# EAGLE design BUZZI-31 (EAGLE 4.15)
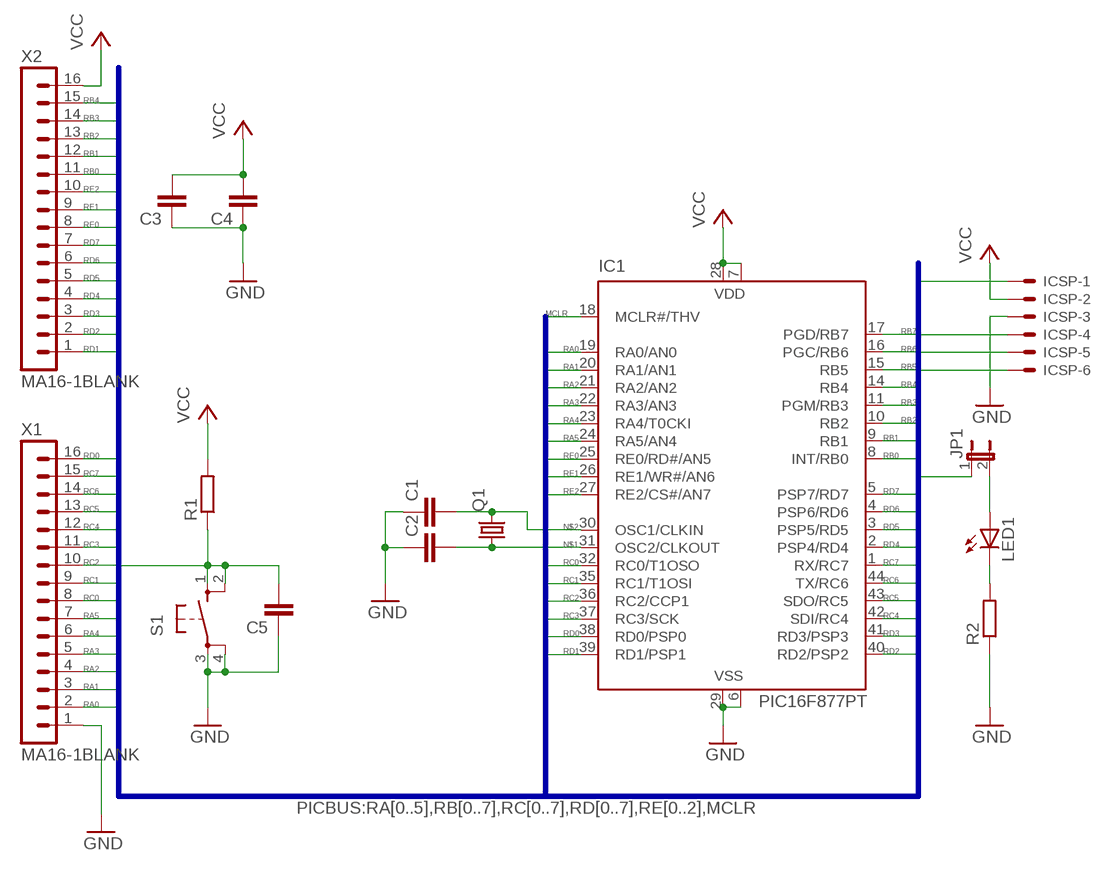
[diagram p0: schematic, sheet 1]

## Parts
C1  C-EUC0805  [C0805]
C2  C-EUC0805  [C0805]
C3  C-EUC0805  [C0805]
C4  C-EUC0805  [C0805]
C5  C-EUC0805  [C0805]
IC1  PIC16F877PT  [TQFP44]
ICSP  53047-06  [53047-06]
JP1  JP1E  [JP1]
LED1  LEDCHIP-LED0805  [CHIP-LED0805]
Q1  CRYTALHC49S  [HC49/S]
R1  R-EU_R0805  [R0805]
R2  R-EU_R0805  [R0805]
S1  10XX  [B3F-10XX]
X1  MA16-1BLANK  [MA16-1-BLANK]
X2  MA16-1BLANK  [MA16-1-BLANK]

## Nets
GND: C1.1 C2.1 C3.1 C4.1 C5.1 IC1.6(VSS) IC1.29(VSS) ICSP.3 R2.1 S1.3 S1.4 X1.1
MCLR: C5.2 IC1.18(MCLR#/THV) ICSP.1 R1.1 S1.1 S1.2
N$1: C2.2 IC1.31(OSC2/CLKOUT) Q1.1
N$2: C1.2 IC1.30(OSC1/CLKIN) Q1.2
N$3: LED1.C R2.2
N$4: JP1.2 LED1.A
RA0: IC1.19(RA0/AN0) X1.2
RA1: IC1.20(RA1/AN1) X1.3
RA2: IC1.21(RA2/AN2) X1.4
RA3: IC1.22(RA3/AN3) X1.5
RA4: IC1.23(RA4/T0CKI) X1.6
RA5: IC1.24(RA5/AN4) X1.7
RB0: IC1.8(INT/RB0) X2.11
RB1: IC1.9(RB1) X2.12
RB2: IC1.10(RB2) X2.13
RB3: IC1.11(PGM/RB3) ICSP.6 X2.14
RB4: IC1.14(RB4) X2.15
RB5: IC1.15(RB5)
RB6: IC1.16(PGC/RB6) ICSP.5
RB7: IC1.17(PGD/RB7) ICSP.4
RC0: IC1.32(RC0/T1OSO) JP1.1 X1.8
RC1: IC1.35(RC1/T1OSI) X1.9
RC2: IC1.36(RC2/CCP1) X1.10
RC3: IC1.37(RC3/SCK) X1.11
RC4: IC1.42(SDI/RC4) X1.12
RC5: IC1.43(SDO/RC5) X1.13
RC6: IC1.44(TX/RC6) X1.14
RC7: IC1.1(RX/RC7) X1.15
RD0: IC1.38(RD0/PSP0) X1.16
RD1: IC1.39(RD1/PSP1) X2.1
RD2: IC1.40(RD2/PSP2) X2.2
RD3: IC1.41(RD3/PSP3) X2.3
RD4: IC1.2(PSP4/RD4) X2.4
RD5: IC1.3(PSP5/RD5) X2.5
RD6: IC1.4(PSP6/RD6) X2.6
RD7: IC1.5(PSP7/RD7) X2.7
RE0: IC1.25(RE0/RD#/AN5) X2.8
RE1: IC1.26(RE1/WR#/AN6) X2.9
RE2: IC1.27(RE2/CS#/AN7) X2.10
VCC: C3.2 C4.2 IC1.7(VDD) IC1.28(VDD) ICSP.2 R1.2 X2.16

## Buses
PICBUS:RA[0..5],RB[0..7],RC[0..7],RD[0..7],RE[0..2],MCLR

## Library data of the parts
C1-C5 = turbod3:C-EU: CAPACITOR, European symbol
IC1 = microchip:PIC16F87*: MICROCONTROLLER
ICSP = con-molex:53?-06: CONNECTOR wire to board 1.25 mm (.049 inch) pitch header
JP1 = jumper:JP1E: JUMPER
LED1 = led:LED: LED OSRAM: - CHIPLED LG R971, LG N971, LY N971, LG Q971, LY Q971, LO R971, LY R971 LH N974, LH R974 LS Q976, LO Q976, LY Q976 LO Q996 - Hyper CHIPLED LW Q18S LB Q993, LB Q99A, LB R99A - SideLED LS A670, LO A670, LY A670, LG A670, LP A670 LB A673, LV A673, LT A673, LW A673 LH A674 LY A675 LS A676, LA A676, LO A676, LY A676, LW A676 LS A679, LY A679, LG A679 - Hyper Micro SIDELED® LS Y876, LA Y876, LO Y876, LY Y876 LT Y87S - SmartLED LW L88C, LW L88S LB L89C, LB L89S, LG L890 LS L89K, LO L89K, LY L89K LS L896, LA L896, LO L896, LY L896 - TOPLED LS T670, LO T670, LY T670, LG T670, LP T670 LSG T670, LSP T670, LSY T670, LOP T670, LYG T670 LG T671, LOG T671, LSG T671 LB T673, LV T673, LT T673, LW T673 LH T674 LS T676, LA T676, LO T676, LY T676, LB T676, LH T676, LSB T676, LW T676 LB T67C, LV T67C, LT T67C, LS T67K, LO T67K, LY T67K, LW E67C LS E67B, LA E67B, LO E67B, LY E67B, LB E67C, LV E67C, LT E67C LW T67C LS T679, LY T679, LG T679 LS T770, LO T770, LY T770, LG T770, LP T770 LB T773, LV T773, LT T773, LW T773 LH T774 LS E675, LA E675, LY E675, LS T675 LS T776, LA T776, LO T776, LY T776, LB T776 LHGB T686 LT T68C, LB T68C - Hyper Mini TOPLED® LB M676 - Mini TOPLED Santana® LG M470 LS M47K, LO M47K, LY M47K Source: http://www.osram.convergy.de/
Q1 = turbod3:CRYTAL: CRYSTAL
R1 R2 = rcl:R-EU_: RESISTOR, European symbol
S1 = KEY_B:10XX
X1 X2 = turbod3:MA16-1

## Board
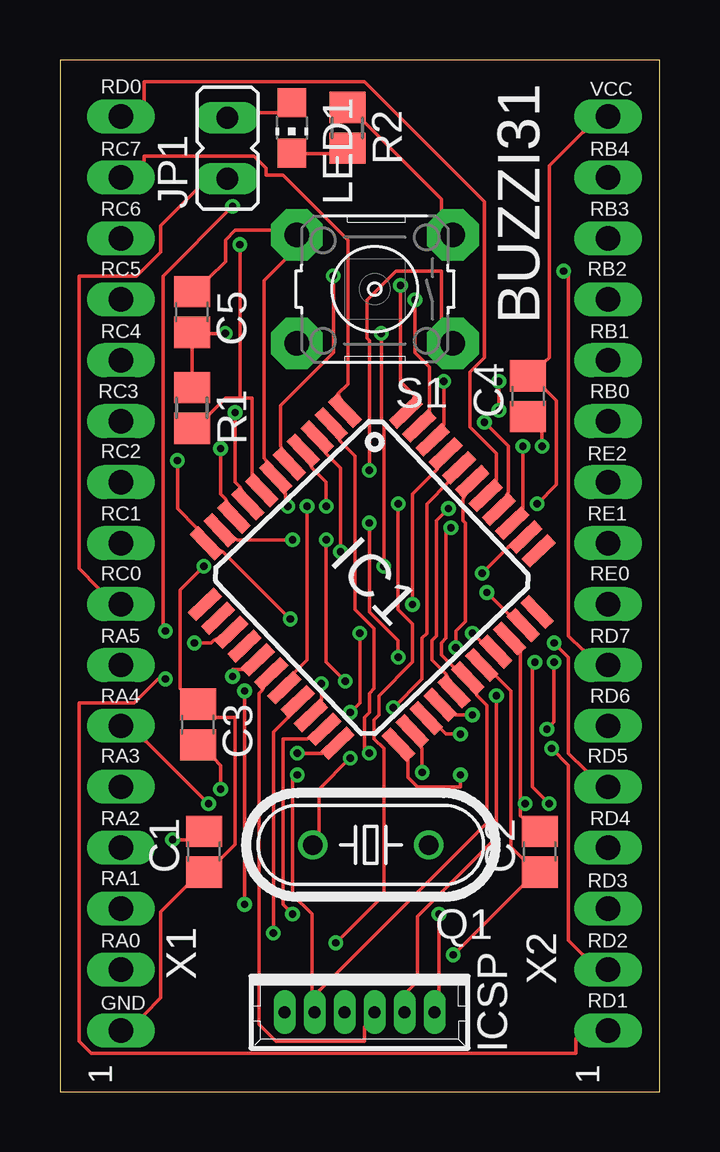
[diagram p1: board, top side]
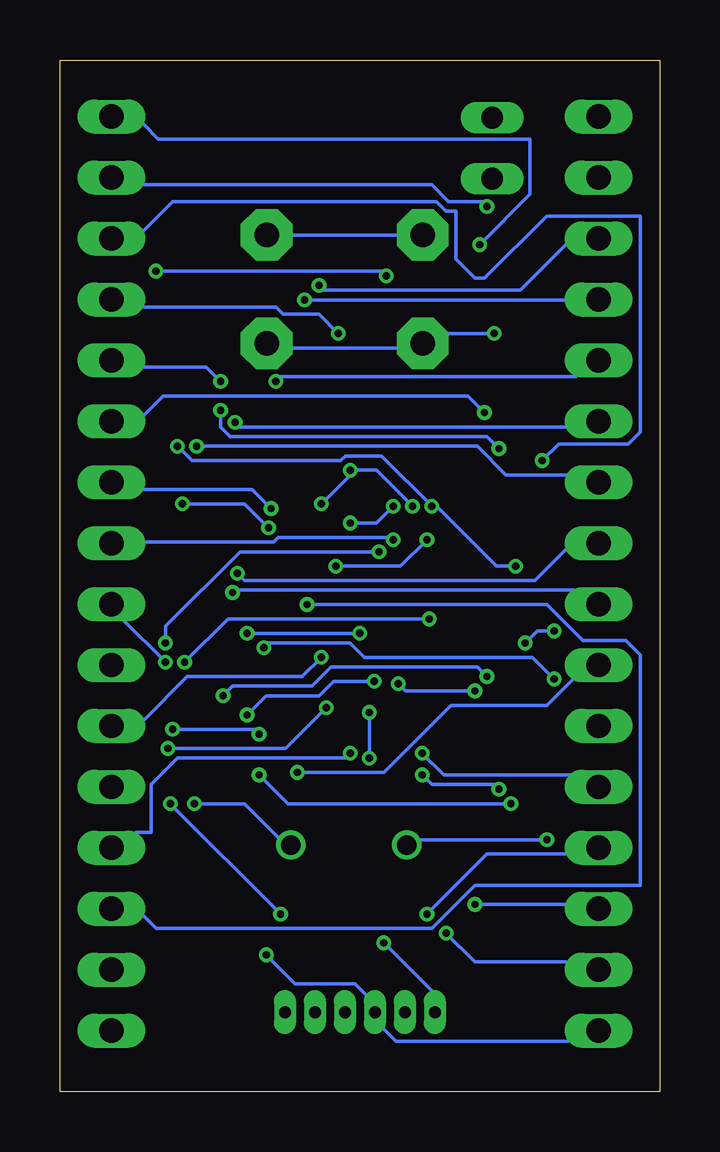
[diagram p2: board, bottom side, seen from below]

Size 25 x 43 mm. Coordinates in mm from the lower left corner, seen from the top.
Outline: 0,0 25,0 25,43 0,43 0,0
Copper layers (1*16): Top 0.035mm / dielectric 1.5mm / Bottom 0.035mm
Design rules "PCB-POOL": minimum track width 6mil, minimum drill 12mil, track to track 6mil, track to pad 6mil, pad to pad 6mil, via to via 6mil, smd to smd 6mil, copper to edge 20mil, drill to drill 8mil, minimum pad ring 8mil, minimum via ring 6mil, stop-mask expansion 3mil, vias tented up to drill 0mil, thermal gap 8mil

### Footprints (pad centres in the part's own frame; a part is rotated, then mirrored left to right if it is on the bottom)
C0805 = smd 1.3 x 1.5: 1 -0.85,0; 2 0.85,0
TQFP44 = smd 1.5 x 0.5: 1 -5.8,4; 2 -5.8,3.2; 3 -5.8,2.4; 4 -5.8,1.6; 5 -5.8,0.8; 6 -5.8,0; 7 -5.8,-0.8; 8 -5.8,-1.6; 9 -5.8,-2.4; 10 -5.8,-3.2; 11 -5.8,-4; 23 5.8,-4; 24 5.8,-3.2; 25 5.8,-2.4; 26 5.8,-1.6; 27 5.8,-0.8; 28 5.8,0; 29 5.8,0.8; 30 5.8,1.6; 31 5.8,2.4; 32 5.8,3.2; 33 5.8,4 | smd 0.5 x 1.5: 12 -4,-5.8; 13 -3.2,-5.8; 14 -2.4,-5.8; 15 -1.6,-5.8; 16 -0.8,-5.8; 17 0,-5.8; 18 0.8,-5.8; 19 1.6,-5.8; 20 2.4,-5.8; 21 3.2,-5.8; 22 4,-5.8; 34 4,5.8; 35 3.2,5.8; 36 2.4,5.8; 37 1.6,5.8; 38 0.8,5.8; 39 0,5.8; 40 -0.8,5.8; 41 -1.6,5.8; 42 -2.4,5.8; 43 -3.2,5.8; 44 -4,5.8
53047-06 = drill 0.5 pad 0.698 long: 1 3.125,0; 2 1.875,0; 3 0.625,0; 4 -0.625,0; 5 -1.875,0; 6 -3.125,0
JP1 = drill 0.914 long: 1 0,-1.27; 2 0,1.27
CHIP-LED0805 = smd 1.2 x 1.2: A 0,-1.05; C 0,1.05
HC49/S = drill 0.813 round: 1 -2.413,0; 2 2.413,0
R0805 = smd 1.3 x 1.5: 1 -0.85,0; 2 0.85,0
B3F-10XX = drill 1.016 pad 2.159 octagon: 1 -3.379,2.312; 2 3.123,2.312; 3 -3.379,-2.209; 4 3.123,-2.209
MA16-1-BLANK = drill 1.016 long: 1 -17.78,0; 2 -15.24,0; 3 -12.7,0; 4 -10.16,0; 5 -7.62,0; 6 -5.08,0; 7 -2.54,0; 8 0,0; 9 2.54,0; 10 5.08,0; 11 7.62,0; 12 10.16,0; 13 12.7,0; 14 15.24,0; 15 17.78,0; 16 20.32,0

### Placement (x,y rotation side)
C1  6,10 90 top
C2  20,10 90 top
C3  5.75,15.3 270 top
C4  19.52,28.98 90 top
C5  5.5,32.5 270 top
IC1  13,21.42 313.7 top
ICSP  12.49,3.31 180 top
JP1  6.98,39.33 0 top
LED1  9.67,40.17 180 top
Q1  12.96,10.28 180 top
R1  5.5,28.5 270 top
R2  11.98,40.17 270 top
S1  13,33.5 180 top
X1  2.54,20.32 90 top
X2  22.86,20.32 90 top

### Tracks (layer width: path | path; a pad name or v marks a point on that pad's centre or on a via)
GND  (via drill 0.3)
  Top 0.152: R2.1 12.7,40.4 15.9,37.2 15.9,36.7 S1.3 | v20.1,26.9 20.1,27.5 C4.1 | v9.5,24.4 9.4,24.5 9.4,24.9 IC1.6 8.6,26.3 8.5,26.4 8.5,33.8 9.4,34.7 S1.4 8.8,35.9 7.3,35.9 6.9,35.5 6.9,34.6 6.2,33.9 C5.1 | IC1.29 18.2,17.3 18.8,16.7 18.8,10.2 19.3,9.7 C2.1 19.3,8.6 v16.4,5.7 | X1.1 3.5,3.2 4.2,3.9 4.2,7.5 5.3,8.6 C1.1 6.7,9.7 7.3,10.3 7.3,15.6 6.4,15.6 C3.1 5.1,16.7 5,16.8 5,20.9 v6,21.9
  Bottom 0.152: v20.1,26.9 19.5,26.3 13.3,26.3 13.1,26.5 11.6,26.5 v9.5,24.4 9.2,24.3 6.8,21.9 v6,21.9 | S1.3 15.3,35.7 10.9,35.7 S1.4 | X1.1 3.8,2.1 11,2.1 11.5,2.6 ICSP.3 12.2,4 12.7,4.5 15.2,4.5 v16.4,5.7
MCLR  (via drill 0.3)
  Top 0.152: R1.1 C5.2 6.2,31.6 v6.9,31.6 | v10.3,24.4 10.3,18 9.8,17.5 IC1.18 | v12.9,25.9 12.9,31.3 12.8,31.4 12.8,33 14,34.2 15.9,34.2 15.9,32.2 S1.1 | v11.5,6.2 13.5,8.2 13.5,14.3 13.1,14.7 13.1,15.5 13.3,15.7 13.3,16.5 14.7,17.9 14.7,19.5 14.1,20.1 v14.1,24.5
  Bottom 0.152: v6.9,31.6 8.8,31.6 S1.2 10.9,31 15.3,31 S1.1 | v10.3,24.4 11.8,25.9 v12.9,25.9 13,25.6 v14.1,24.5 | v11.5,6.2 9.5,4.2 ICSP.1
N$1  (via drill 0.3)
  Top 0.152: 19.2,12 19.2,18.3 IC1.31 | 19.2,12 19.2,11.5 19.3,11.4 C2.2 | v19.4,12 19.2,12
  Bottom 0.152: v19.4,12 17.3,12 15.9,10.6 Q1.1
N$2  (via drill 0.3)
  Top 0.152: v4.7,10.5 5.3,10.5 C1.2 | v17.2,19.1 17.5,18.8 IC1.30 | v12.5,19.1 12.5,16.2 v12.1,15.8 | v12.1,13.9 10.8,12.6 10.8,10.8 Q1.2
  Bottom 0.152: v4.7,10.5 10,10.5 Q1.2 | v12.5,19.1 v17.2,19.1 | v12.1,13.9 v12.1,15.8
N$3
  Top 0.152: LED1.C 10.2,39.1 11.3,39.1 R2.2
N$4
  Top 0.152: LED1.A 9.1,40.8 8.3,40.8 JP1.2
RA0  (via drill 0.3)
  Top 0.152: v8.9,6.6 8.9,15 9.5,15.6 IC1.19
  Bottom 0.152: v8.9,6.6 7.7,5.4 3.9,5.4 X1.2
RA1  (via drill 0.3)
  Top 0.152: v10.9,17 10.9,16.3 IC1.20 | v7.7,7.8 v7.7,16.7
  Bottom 0.152: v10.9,17 10.6,16.7 v7.7,16.7 | v7.7,7.8 3.9,7.8 X1.3
RA2  (via drill 0.3)
  Top 0.152: v9.7,7.4 9.3,7.8 9.3,14.7 10.3,14.7 IC1.21
  Bottom 0.152: v9.7,7.4 7.2,9.9 3.9,9.9 X1.4
RA3  (via drill 0.3)
  Top 0.152: v9.9,14.1 10.9,14.1 IC1.22
  Bottom 0.152: v9.9,14.1 9,13.2 3.7,13.2 X1.5
RA4  (via drill 0.3)
  Top 0.152: v16.7,13.2 16.7,12.7 14.9,12.7 14.5,13.1 14.5,13.8 IC1.23 | v6.2,12 3.6,14.6 X1.6
  Bottom 0.152: v16.7,13.2 15.5,12 v6.2,12
RA5  (via drill 0.3)
  Top 0.152: v15.1,13.3 15.1,14.3 IC1.24
  Bottom 0.152: v15.1,13.3 11.5,13.3 8.7,16.1 4.7,16.1 3.6,17.2 X1.7
RB0  (via drill 0.3)
  Top 0.152: v7.3,28.3 7.3,25.4 7.5,25.2 IC1.8
  Bottom 0.152: v7.3,28.3 8,29 20.7,29 21.5,28.2 X2.11
RB1  (via drill 0.3)
  Top 0.152: v6.7,26.8 6.7,24.9 6.9,24.7 IC1.9 | v18.3,28.4 v18.3,29.6
  Bottom 0.152: v6.7,26.8 7.2,27.3 17.9,27.3 18.3,27.7 v18.3,28.4 | v18.3,29.6 18.9,30.2 21.5,30.2 X2.12
RB2  (via drill 0.3)
  Top 0.152: v9.7,23 7.4,23 IC1.10 | v13.5,21.9 13.5,27.8 13.4,27.9 v13.4,31.6
  Bottom 0.152: v9.7,23 10.8,21.9 v13.5,21.9 | v13.4,31.6 14.2,32.4 15.7,32.4 16,32.7 21.5,32.7 X2.13
RB3  (via drill 0.3)
  Top 0.152: v4.9,26.3 4.9,24.3 5.7,23.5 IC1.11 6.8,22.5 v9.6,19.7 | v15.8,7.4 15.8,4.2 ICSP.6 | v20.4,12 19.7,12.7 19.7,17.8 v19.8,17.9
  Bottom 0.152: v4.9,26.3 4.2,27 1.3,27 0.8,27.5 0.8,36.5 4.7,36.5 7.3,33.9 7.7,33.9 8.5,34.7 8.5,36.7 8.9,36.7 9.3,37.1 20.3,37.1 21.5,35.9 X2.14 | v15.8,7.4 v20.4,12 | v19.8,17.9 18,19.7 v9.6,19.7
RB4  (via drill 0.3)
  Top 0.152: v5.6,18.7 6.3,18.7 6.4,18.8 IC1.14 | v4.4,19.2 4.3,19.3 4.3,34 v7.2,36.9
  Bottom 0.152: v5.6,18.7 5.1,19.2 v4.4,19.2 | v7.2,36.9 7.4,37.1 8.8,37.1 9.5,37.8 21.5,37.8 X2.15
RB6  (via drill 0.3)
  Top 0.152: v7.2,17.3 7.2,17.6 7.6,17.6 IC1.16 | v18.2,16.5 18.2,10.6 14.9,7.3 14.9,4.6 14.5,4.2 ICSP.5
  Bottom 0.152: v7.2,17.3 7.6,17.7 13.7,17.7 14.5,16.9 17.8,16.9 v18.2,16.5
RB7
  Top 0.152: IC1.17 8.4,16.7 8.3,16.6 8.3,2.8 9,2.1 12.7,2.1 12.7,2.7 ICSP.4
RC0  (via drill 0.3)
  Top 0.152: v17.8,20.8 18.7,19.9 IC1.32 | JP1.1 5.8,37.7 4.2,36.1 4.2,35 3.2,34 0.8,34 0.8,21.8 1.6,21 X1.8
  Bottom 0.152: v17.8,20.8 17.7,20.9 3.6,20.9 X1.8
RC1  (via drill 0.3)
  Top 0.152: v17.6,21.6 18.7,22.7 IC1.35
  Bottom 0.152: v17.6,21.6 17.3,21.3 5.2,21.3 3.9,22.6 X1.9
RC2  (via drill 0.3)
  Top 0.152: v19.3,26.9 19.3,24.3 IC1.36
  Bottom 0.152: v19.3,26.9 7.6,26.9 6.4,25.7 3.9,25.7 X1.10
RC3  (via drill 0.3)
  Top 0.152: v17.7,27.9 18.7,26.9 18.7,25 IC1.37
  Bottom 0.152: v17.7,27.9 17.5,27.7 3.9,27.7 X1.11
RC4  (via drill 0.3)
  Top 0.152: v16,29.6 16,27.8 IC1.42
  Bottom 0.152: v16,29.6 15.8,29.8 3.5,29.8 X1.12
RC5  (via drill 0.3)
  Top 0.152: v14.8,33 14.8,30.8 15.4,30.2 15.4,28.4 IC1.43
  Bottom 0.152: v14.8,33 3.9,33 X1.13
RC6  (via drill 0.3)
  Top 0.152: v14.2,33.6 14.2,29.6 14.8,29 IC1.44
  Bottom 0.152: v14.2,33.6 14,33.4 5.8,33.4 3.9,35.3 X1.14
RC7
  Top 0.152: IC1.1 11.6,29.1 12,29.5 12,35.5 9.3,38.2 8.6,38.2 8.6,38.5 8.1,39 3.5,39 3.5,38.8 X1.15
RD0
  Top 0.152: IC1.38 18.2,25.5 18.2,26.6 17.1,27.7 17.1,30 17.7,30.6 17.7,37.1 12.7,42.1 3.5,42.1 3.5,41.3 X1.16
RD1  (via drill 0.3)
  Top 0.152: v16.5,18.5 16.5,19.2 16.9,19.6 16.9,23.7 16.8,23.8 16.8,24.7 IC1.39 | v4.4,17.2 4.1,17.2 3.1,16.2 0.8,16.2 0.8,2.1 1.3,1.6 21.5,1.6 21.5,2.2 X2.1
  Bottom 0.152: v16.5,18.5 16.3,18.7 12.9,18.7 12.3,18.1 5.3,18.1 v4.4,17.2
RD2  (via drill 0.3)
  Top 0.152: v13.9,16 15.1,17.2 15.1,18.9 15.3,19.1 15.3,24.5 16.2,25.4 IC1.40 | v20.5,14.3 21.2,13.6 21.2,6.3 21.8,5.7 X2.2
  Bottom 0.152: v13.9,16 15.6,14.3 v20.5,14.3
RD3  (via drill 0.3)
  Top 0.152: v14.7,20.3 14.7,24.9 15.7,25.9 IC1.41
  Bottom 0.152: v14.7,20.3 4.7,20.3 3.2,18.8 1.4,18.8 0.8,18.2 0.8,8.6 7.7,8.6 9.5,6.8 21,6.8 21.5,7.3 X2.3
RD4  (via drill 0.3)
  Top 0.152: v12.9,14.1 12.7,14.3 12.7,15.6 12.9,15.8 12.9,16.6 13.1,16.8 13.1,19.3 12.3,20.1 12.3,26.5 11.7,27.1 IC1.2
  Bottom 0.152: v12.9,14.1 13.1,13.9 20.1,13.9 21.2,12.8 21.2,10.8 21.8,10.8 X2.4
RD5  (via drill 0.3)
  Top 0.152: v11.7,22.5 11.7,26 11.1,26.6 IC1.3 | v20.6,18.7 21.2,18.1 21.2,14.1 21.9,13.4 X2.5
  Bottom 0.152: v11.7,22.5 17.5,22.5 20.6,19.4 v20.6,18.7
RD6  (via drill 0.3)
  Top 0.152: v11.1,24.4 11.1,25.4 10.5,26 IC1.4 | v12.9,23.7 12.9,20 14.1,18.8 v14.1,18.1
  Bottom 0.152: v11.1,24.4 11.8,23.7 v12.9,23.7 | v14.1,18.1 14.9,17.3 19.7,17.3 21.5,15.5 X2.6
RD7  (via drill 0.3)
  Top 0.152: v11.4,34 11.4,30.8 9.2,28.6 9.2,26.9 IC1.5 | v21,34.2 21.2,34 21.2,19 21.8,18.4 X2.7
  Bottom 0.152: v11.4,34 11.6,34.2 v21,34.2
RE0  (via drill 0.3)
  Top 0.152: v16.7,14.9 16.1,14.9 15.9,15.1 IC1.25 | v20.3,15.1 20.6,15.4 v20.6,17.9
  Bottom 0.152: v16.7,14.9 16.9,15.1 v20.3,15.1 | v20.6,17.9 22.4,19.7 X2.8
RE1  (via drill 0.3)
  Top 0.152: v17.2,15.7 16.5,15.7 IC1.26 | v11.9,17.1 11.1,17.9 v11.1,23
  Bottom 0.152: v17.2,15.7 16.4,16.5 14.2,16.5 13.6,17.1 v11.9,17.1 | v11.1,23 11.2,23.1 15.9,23.1 16.1,22.9 21.5,22.9 X2.9
RE2  (via drill 0.3)
  Top 0.152: v16.2,24.3 15.7,23.8 15.7,19 15.5,18.8 15.5,18 16.1,17.4 IC1.27
  Bottom 0.152: v16.2,24.3 17,25.1 21.5,25.1 X2.10
VCC  (via drill 0.3)
  Top 0.152: v6.7,12.6 6.7,13.6 6.4,13.9 C3.2 | v9.9,13.2 9.7,13 9.7,8.2 10.5,7.4 10.5,4.2 ICSP.2 10.8,4.2 17.8,11.2 17.8,16.1 17.4,16.5 IC1.28 16.4,17.7 15.9,18.2 15.9,18.7 16.1,18.9 16.1,23.3 v16.3,23.5 | 7.5,28.9 8,28.9 8,25.7 IC1.7 | 7.5,28.9 6.9,28.9 6.2,28.2 R1.2 | X2.16 21.8,40 20.4,38.6 20.4,30.6 20.2,30.4 C4.2 20.2,29.3 20.7,28.8 20.7,25.3 v19.9,24.5 | v7.5,35.3 7.5,28.9
  Bottom 0.152: v6.7,12.6 6.9,12.8 9.5,12.8 v9.9,13.2 | v7.5,35.3 5.4,37.4 5.4,39.7 20.9,39.7 21.5,40.3 X2.16 | v16.3,23.5 17.3,24.5 v19.9,24.5

### Text on the board
tNames: RD0 | VCC | RC7 | RB4 | RC6 | RB3 | RC5 | RB2 | BUZZI31 | RC4 | RB1 | RC3 | RB0 | RC2 | RE2 | RC1 | RE1 | RC0 | RE0 | RA5 | RD7 | RA4 | RD6 | RA3 | RD5 | RA2 | RD4 | RA1 | RD3 | RA0 | RD2 | RD1 | GND